# Altium project FireWireSw_v2.PrjPcb
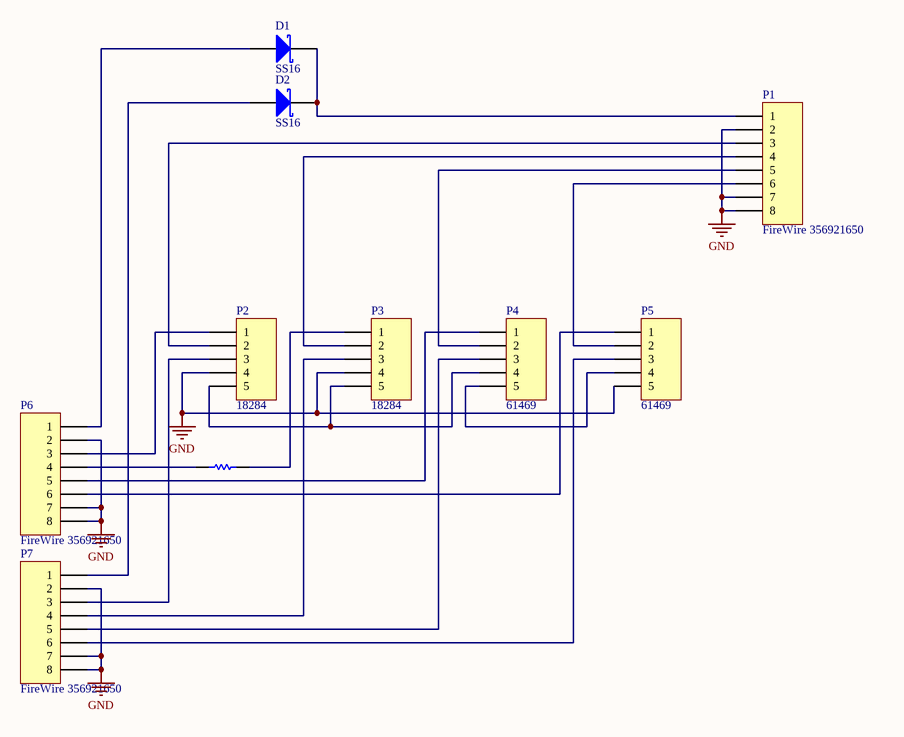
[diagram p0: sch.SchDoc]
1 sheet, 10 parts. Net scope: global (net labels, ports and power ports of the same name join across sheets).
Board file: brd.PcbDoc

## Sheet sch.SchDoc
size A4

### Parts
D1  SS16  [RR_SMB]
D2  SS16  [RR_SMB]
P1  FireWire 356921650  [DS1102]
P2  18284  [RES55A]
P3  18284  [RES55A]
P4  61469  [RES55A]
P5  61469  [RES55A]
P6  FireWire 356921650  [DS1102]
P7  FireWire 356921650  [DS1102]
R1  Res1  [0805]  (value not drawn)

### Nets
GND: P1.2 P1.7 P1.8 P2.4 P3.4 P5.5 P6.2 P6.7 P6.8 P7.2 P7.7 P7.8
NetD1_1: D1.1(A) P6.1
NetD1_2: D1.2(K) D2.2(K) P1.1
NetD2_1: D2.1(A) P7.1
NetP1_3: P1.3 P2.2
NetP1_4: P1.4 P3.2
NetP1_5: P1.5 P4.2
NetP1_6: P1.6 P5.2
NetP2_1: P2.1 P6.3
NetP2_3: P2.3 P7.3
NetP2_5: P2.5 P3.5 P4.4
NetP3_1: P3.1 R1.2
NetP3_3: P3.3 P7.4
NetP4_1: P4.1 P6.5
NetP4_3: P4.3 P7.5
NetP4_5: P4.5 P5.4
NetP5_1: P5.1 P6.6
NetP5_3: P5.3 P7.6
NetP6_4: P6.4 R1.1

### Library data of the parts
D1 D2 = SS16: DIODE SCHOTTKY 60V 1A SMA; Manufacturer: FairchildSemiconductor; Order Number: SS16T3G; Package: SMA; Value: DIODE SCHOTTKY 60V 1A SMA; Cost: 0,43
P1 P6 P7 = Header 8: IEEE 1394 (DS1102), SMD розетка на плату (OBSOLETE); LatestRevisionDate: 17-Jul-2002; LatestRevisionNote: Re-released for DXP Platform.; Publisher: Altium Limited
P2-P5 = Header 5: Header, 5-Pin; LatestRevisionDate: 17-Jul-2002; LatestRevisionNote: Re-released for DXP Platform.; Publisher: Altium Limited
R1 = Res1: Resistor; Value: 1K; Published: 8-Jun-2000; LatestRevisionDate: 17-Jul-2002; LatestRevisionNote: Re-released for DXP Platform.; PackageReference: AXIAL-0.3; Publisher: Altium Limited; PackageDescription: Axial Device, Thru-Hole; 2 Leads; 0.3 in Pin Spacing